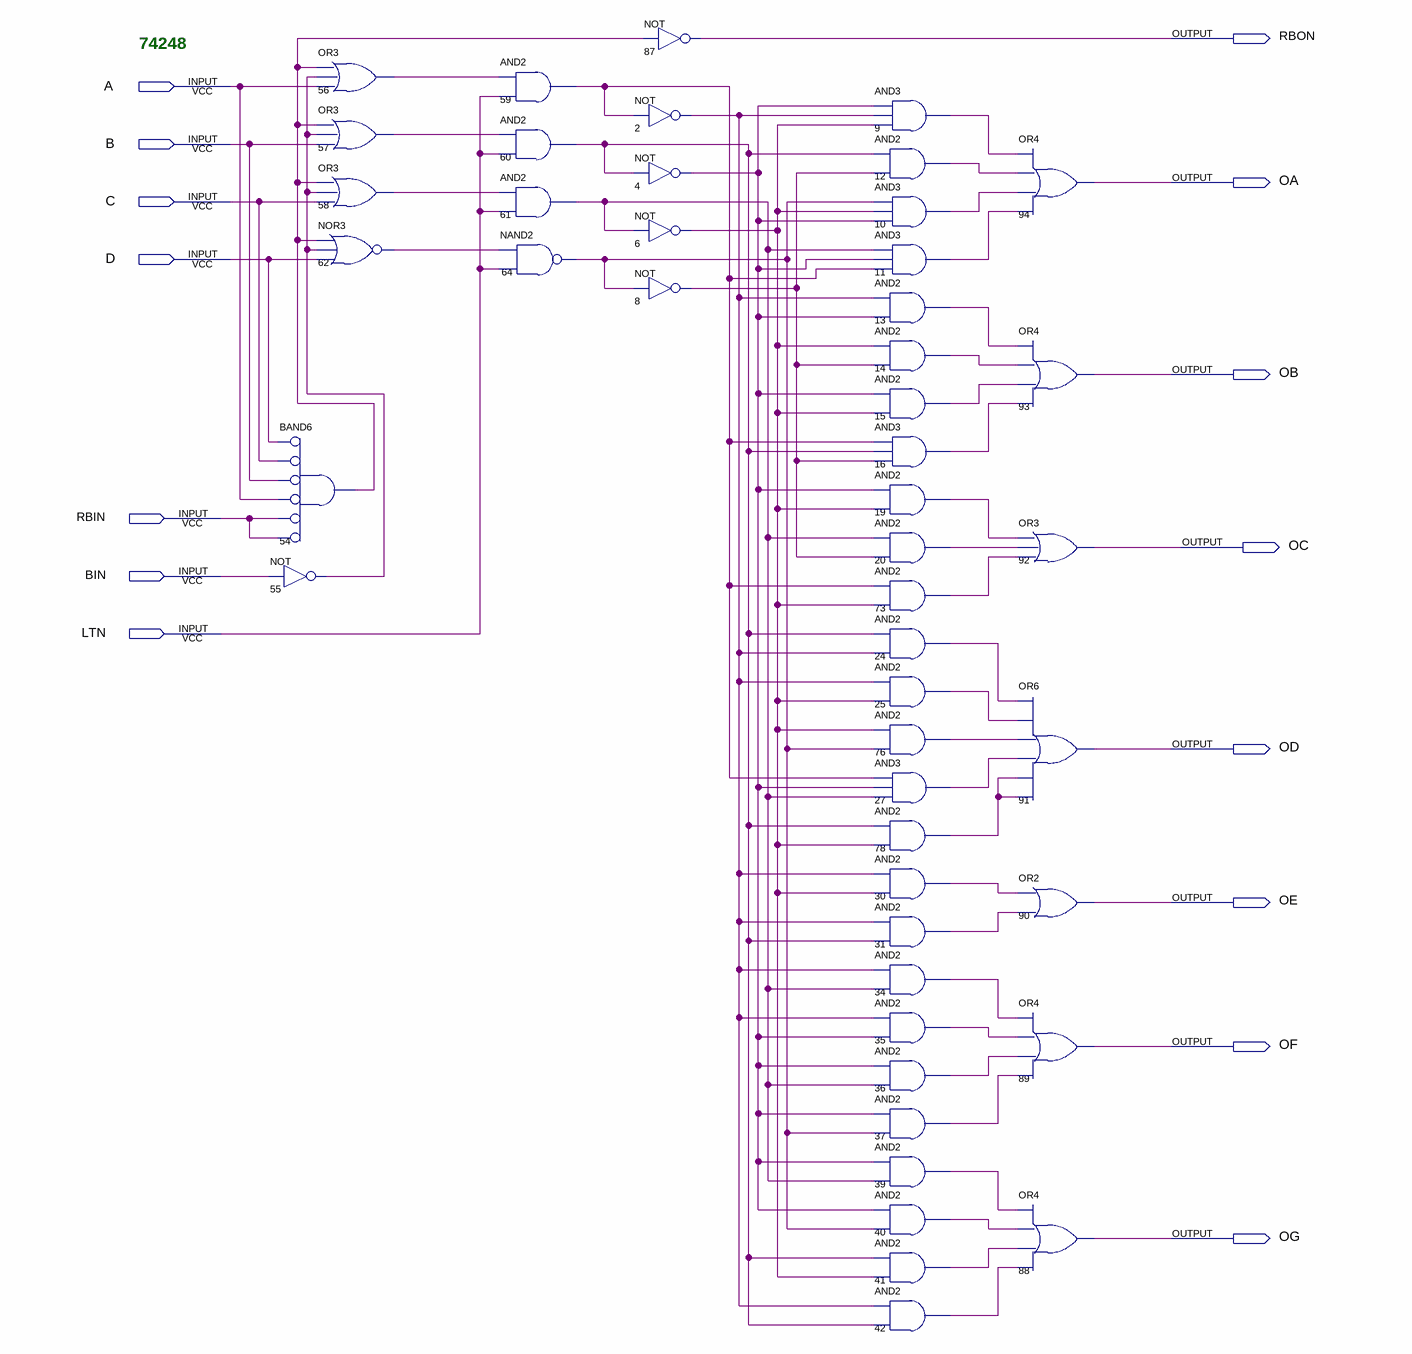
[diagram p0: schematic sheet]
// Quartus schematic 74248.bdf as structural Verilog: 48 symbols, 15 pins
module \74248  (
  input  A,
  input  B,
  input  C,
  input  D,
  input  RBIN,
  input  BIN,
  input  LTN,
  output RBON,
  output OA,
  output OB,
  output OC,
  output OD,
  output OE,
  output OF,
  output OG
);

  wire n2_out, n4_out, n6_out, n8_out, n9_out, n10_out, n11_out, n12_out, n13_out, n14_out, n15_out, n16_out,
       n19_out, n20_out, n24_out, n25_out, n27_out, n30_out, n31_out, n34_out, n35_out, n36_out, n37_out,
       n39_out, n40_out, n41_out, n42_out, n54_out, n55_out, n56_out, n57_out, n58_out, n59_out, n60_out,
       n61_out, n62_out, n64_out, n73_out, n76_out, n78_out;

  and u_54 (n54_out, ~D, ~C, ~B, ~A, ~RBIN, ~RBIN);  // BAND6
  not u_55 (n55_out, BIN);
  or u_56 (n56_out, n54_out, n55_out, A);
  or u_57 (n57_out, n54_out, n55_out, B);
  or u_58 (n58_out, n54_out, n55_out, C);
  nor u_62 (n62_out, n54_out, n55_out, D);
  and u_59 (n59_out, n56_out, LTN);
  and u_60 (n60_out, n57_out, LTN);
  and u_61 (n61_out, n58_out, LTN);
  nand u_64 (n64_out, n62_out, LTN);
  not u_87 (RBON, n54_out);
  not u_2 (n2_out, n59_out);
  not u_4 (n4_out, n60_out);
  not u_6 (n6_out, n61_out);
  not u_8 (n8_out, n64_out);
  and u_9 (n9_out, n4_out, n2_out, n6_out);
  and u_12 (n12_out, n60_out, n8_out);
  and u_10 (n10_out, n64_out, n6_out, n4_out);
  and u_11 (n11_out, n61_out, n4_out, n59_out);
  and u_13 (n13_out, n2_out, n4_out);
  and u_14 (n14_out, n6_out, n8_out);
  and u_15 (n15_out, n4_out, n6_out);
  and u_16 (n16_out, n59_out, n60_out, n8_out);
  and u_19 (n19_out, n4_out, n6_out);
  and u_20 (n20_out, n61_out, n8_out);
  and u_73 (n73_out, n59_out, n6_out);
  and u_24 (n24_out, n60_out, n2_out);
  and u_25 (n25_out, n2_out, n6_out);
  and u_76 (n76_out, n6_out, n64_out);
  and u_27 (n27_out, n59_out, n4_out, n61_out);
  and u_78 (n78_out, n60_out, n6_out);
  and u_30 (n30_out, n2_out, n6_out);
  and u_31 (n31_out, n2_out, n60_out);
  and u_34 (n34_out, n2_out, n61_out);
  and u_35 (n35_out, n2_out, n4_out);
  and u_36 (n36_out, n4_out, n61_out);
  and u_37 (n37_out, n4_out, n64_out);
  and u_39 (n39_out, n4_out, n61_out);
  and u_40 (n40_out, n4_out, n64_out);
  and u_41 (n41_out, n60_out, n6_out);
  and u_42 (n42_out, n2_out, n60_out);
  or u_94 (OA, n9_out, n12_out, n10_out, n11_out);
  or u_93 (OB, n13_out, n14_out, n15_out, n16_out);
  or u_92 (OC, n19_out, n20_out, n73_out);
  or u_91 (OD, n24_out, n25_out, n76_out, n27_out, n78_out, n78_out);
  or u_90 (OE, n30_out, n31_out);
  or u_89 (OF, n34_out, n35_out, n36_out, n37_out);
  or u_88 (OG, n39_out, n40_out, n41_out, n42_out);

  // Notes on the sheet:
  //   74248
endmodule
